# Altium schematic sheet TOP_LEVEL.SchDoc
size Tabloid; SheetNumber: 1; SheetTotal: 11
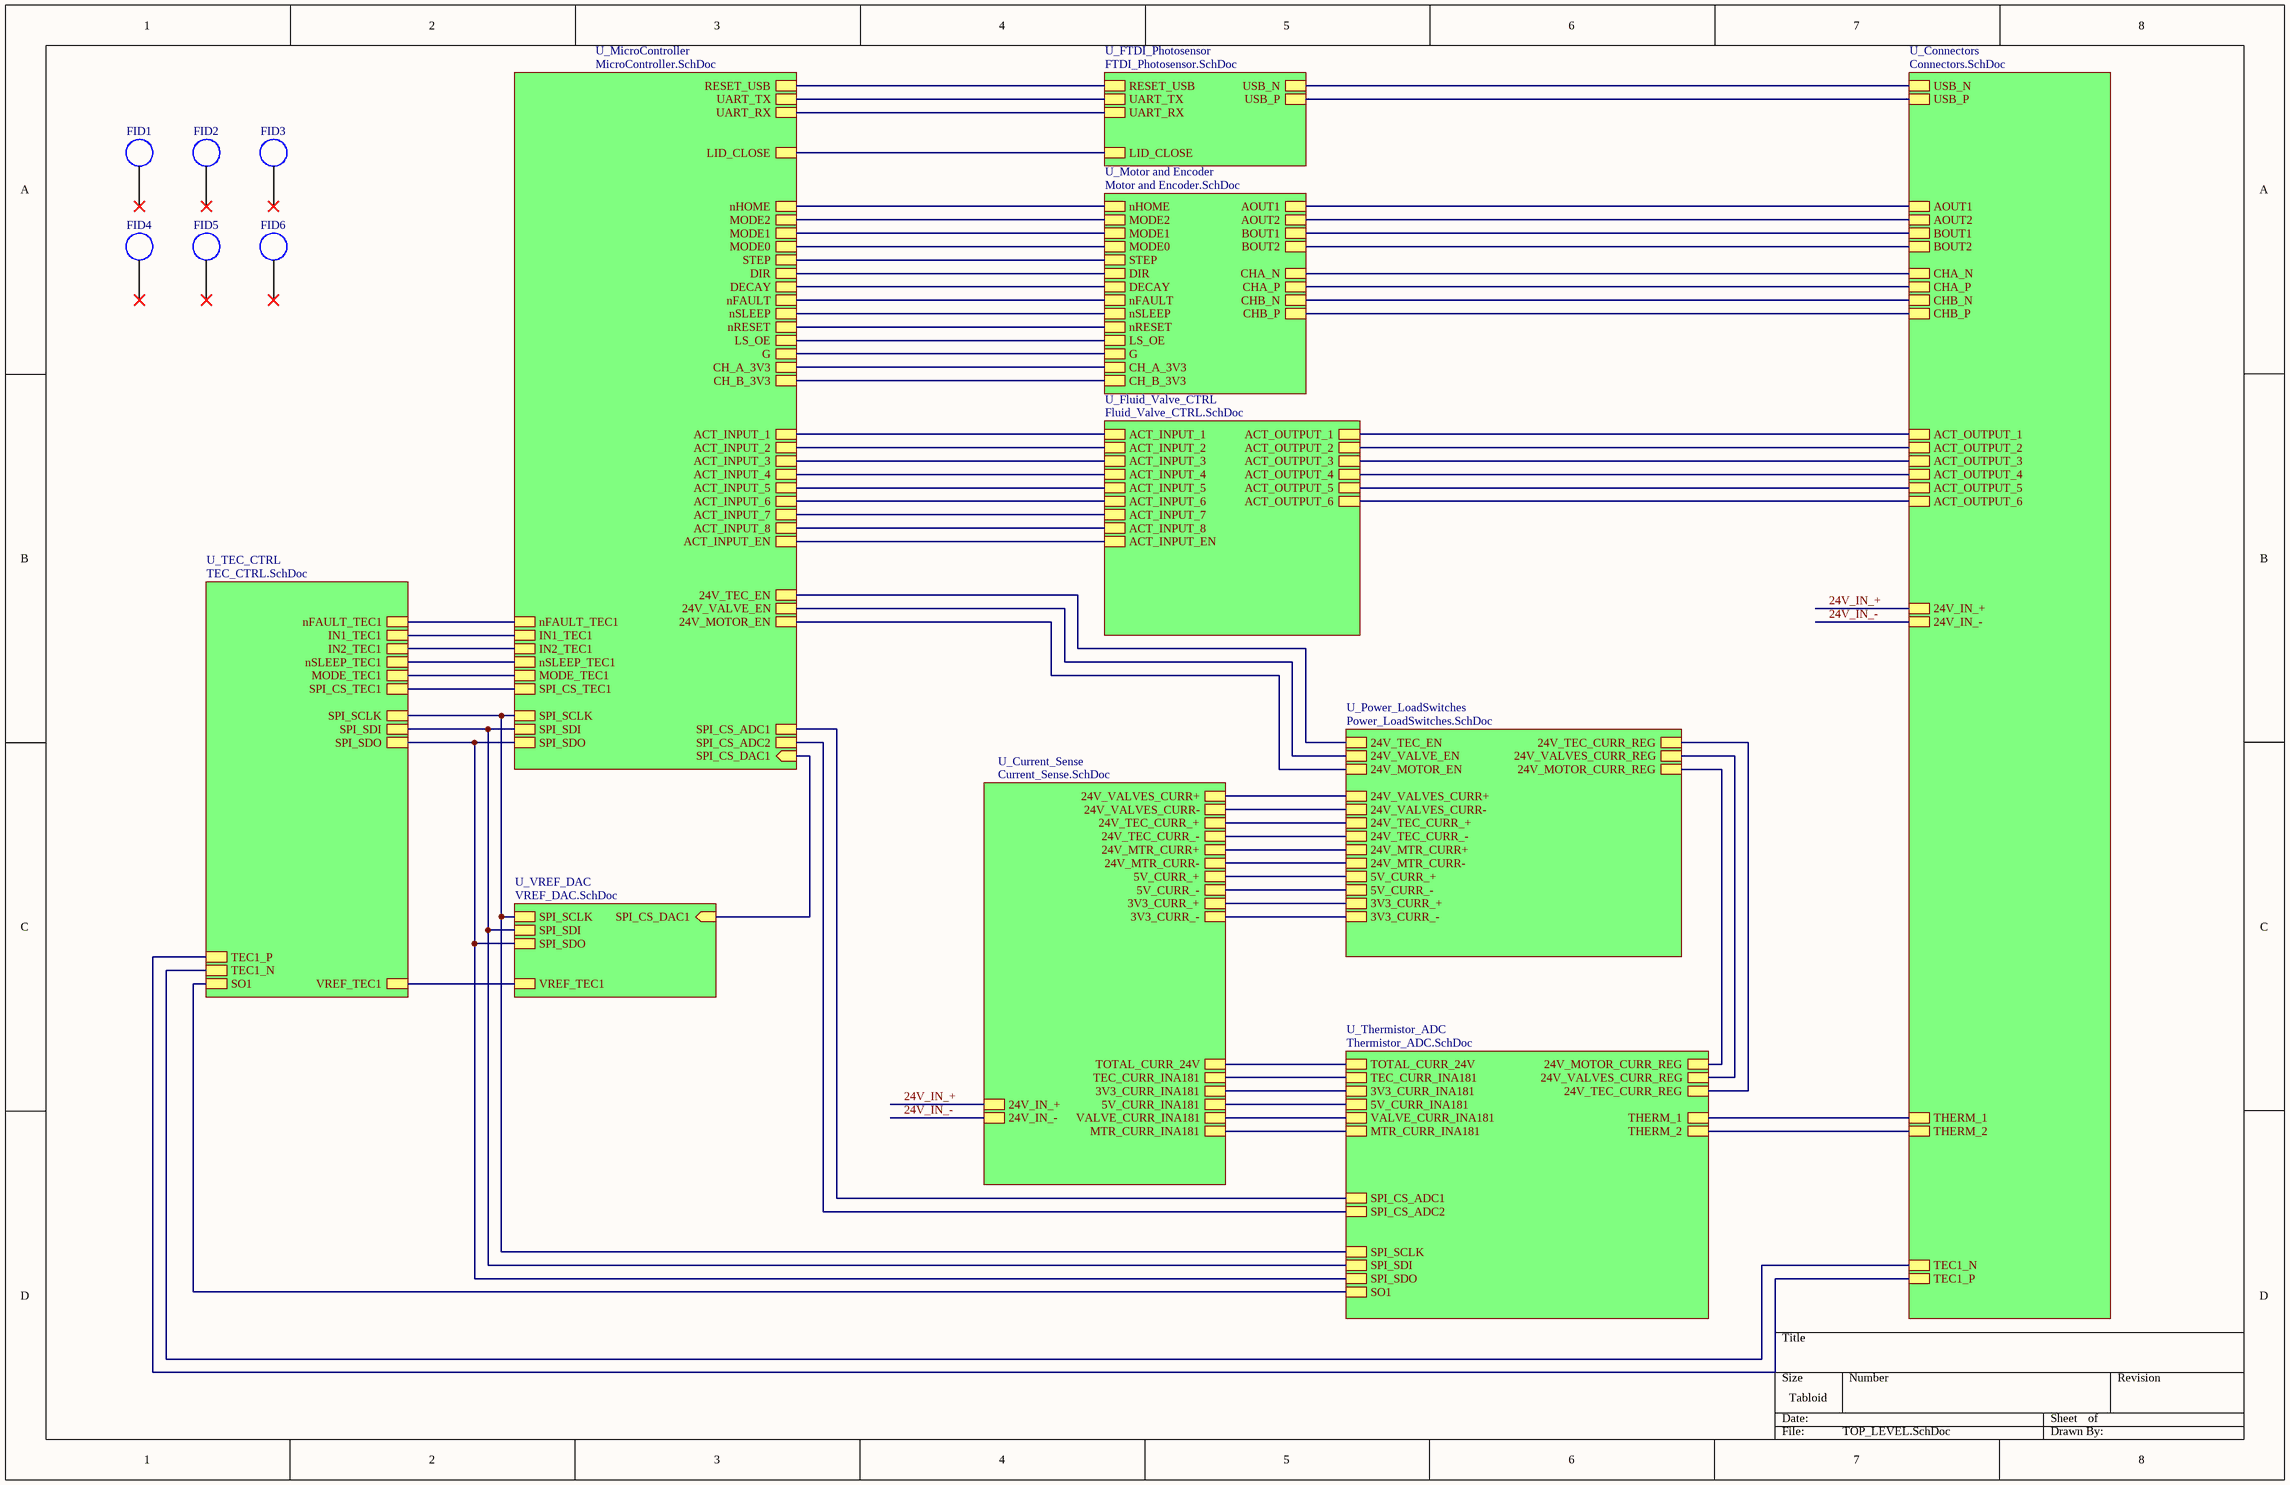
[diagram p0: TOP_LEVEL.SchDoc]

## Parts
FID1  FIDUCIAL  [Fiducial]  (value not drawn)
FID2  FIDUCIAL  [Fiducial]  (value not drawn)
FID3  FIDUCIAL  [Fiducial]  (value not drawn)
FID4  FIDUCIAL  [Fiducial]  (value not drawn)
FID5  FIDUCIAL  [Fiducial]  (value not drawn)
FID6  FIDUCIAL  [Fiducial]  (value not drawn)

## Sub-sheets
U_Connectors = Connectors.SchDoc: 24V_IN_+, 24V_IN_-, TEC1_P, TEC1_N, THERM_1, THERM_2, ACT_OUTPUT_1, ACT_OUTPUT_2, ACT_OUTPUT_3, ACT_OUTPUT_4, ACT_OUTPUT_5, ACT_OUTPUT_6, CHA_N, CHA_P, CHB_N, CHB_P, AOUT1, AOUT2, BOUT1, BOUT2, USB_N, USB_P
U_Current_Sense = Current_Sense.SchDoc: 24V_TEC_CURR_+, 24V_TEC_CURR_-, TEC_CURR_INA181, TOTAL_CURR_24V, 24V_IN_+, 24V_IN_-, 24V_VALVES_CURR+, 24V_VALVES_CURR-, VALVE_CURR_INA181, 5V_CURR_INA181, 3V3_CURR_INA181, 5V_CURR_+, 5V_CURR_-, 3V3_CURR_+, 3V3_CURR_-, 24V_MTR_CURR+, 24V_MTR_CURR-, MTR_CURR_INA181
U_Fluid_Valve_CTRL = Fluid_Valve_CTRL.SchDoc: ACT_INPUT_1, ACT_INPUT_2, ACT_INPUT_3, ACT_INPUT_4, ACT_OUTPUT_1, ACT_OUTPUT_2, ACT_OUTPUT_3, ACT_OUTPUT_4, ACT_INPUT_5, ACT_INPUT_6, ACT_INPUT_7, ACT_INPUT_8, ACT_OUTPUT_5, ACT_OUTPUT_6, ACT_INPUT_EN
U_FTDI_Photosensor = FTDI_Photosensor.SchDoc: RESET_USB, USB_N, USB_P, UART_TX, UART_RX, LID_CLOSE
U_MicroController = MicroController.SchDoc: UART_TX, UART_RX, nHOME, nFAULT, nSLEEP, nRESET, SPI_CS_DAC1 (in), SPI_CS_ADC1, SPI_CS_ADC2, CH_A_3V3, CH_B_3V3, IN1_TEC1, IN2_TEC1, nSLEEP_TEC1, MODE_TEC1, SPI_SCLK, SPI_SDI, SPI_CS_TEC1, nFAULT_TEC1, LS_OE, G, MODE2, MODE1, MODE0, STEP, DIR, DECAY, 24V_MOTOR_EN, 24V_VALVE_EN, 24V_TEC_EN, LID_CLOSE, SPI_SDO, ACT_INPUT_EN, RESET_USB, ACT_INPUT_1, ACT_INPUT_2, ACT_INPUT_3, ACT_INPUT_4, ACT_INPUT_5, ACT_INPUT_6, ACT_INPUT_7, ACT_INPUT_8
U_Motor and Encoder = Motor and Encoder.SchDoc: AOUT1, AOUT2, BOUT1, BOUT2, nHOME, MODE2, MODE1, MODE0, STEP, DIR, DECAY, nFAULT, nSLEEP, nRESET, CHA_N, CHA_P, CHB_N, CHB_P, G, CH_A_3V3, CH_B_3V3, LS_OE
U_Power_LoadSwitches = Power_LoadSwitches.SchDoc: 24V_TEC_EN, 24V_TEC_CURR_REG, 24V_VALVE_EN, 24V_VALVES_CURR_REG, 24V_VALVES_CURR+, 24V_VALVES_CURR-, 24V_TEC_CURR_+, 24V_TEC_CURR_-, 24V_MOTOR_EN, 24V_MOTOR_CURR_REG, 24V_MTR_CURR+, 24V_MTR_CURR-, 5V_CURR_+, 5V_CURR_-, 3V3_CURR_+, 3V3_CURR_-
U_TEC_CTRL = TEC_CTRL.SchDoc: IN1_TEC1, IN2_TEC1, nSLEEP_TEC1, MODE_TEC1, SPI_SCLK, SPI_SDI, SPI_CS_TEC1, SPI_SDO, nFAULT_TEC1, TEC1_P, TEC1_N, SO1, VREF_TEC1
U_Thermistor_ADC = Thermistor_ADC.SchDoc: THERM_1, THERM_2, SPI_CS_ADC1, 24V_TEC_CURR_REG, 24V_VALVES_CURR_REG, TEC_CURR_INA181, TOTAL_CURR_24V, VALVE_CURR_INA181, SPI_CS_ADC2, SPI_SDO, SPI_SDI, SPI_SCLK, 5V_CURR_INA181, 3V3_CURR_INA181, 24V_MOTOR_CURR_REG, SO1, MTR_CURR_INA181
U_VREF_DAC = VREF_DAC.SchDoc: VREF_TEC1, SPI_CS_DAC1 (in), SPI_SCLK, SPI_SDI, SPI_SDO

## Nets
24V_IN_+: sheet U_Current_Sense/24V_IN_+, sheet U_Connectors/24V_IN_+
24V_IN_-: sheet U_Current_Sense/24V_IN_-, sheet U_Connectors/24V_IN_-
(unnamed): sheet U_Motor and Encoder/AOUT1, sheet U_Connectors/AOUT1
(unnamed): sheet U_Motor and Encoder/AOUT2, sheet U_Connectors/AOUT2
(unnamed): sheet U_Motor and Encoder/BOUT1, sheet U_Connectors/BOUT1
(unnamed): sheet U_Motor and Encoder/BOUT2, sheet U_Connectors/BOUT2
(unnamed): sheet U_Motor and Encoder/nHOME, sheet U_MicroController/nHOME
(unnamed): sheet U_Motor and Encoder/MODE2, sheet U_MicroController/MODE2
(unnamed): sheet U_Motor and Encoder/MODE1, sheet U_MicroController/MODE1
(unnamed): sheet U_Motor and Encoder/MODE0, sheet U_MicroController/MODE0
(unnamed): sheet U_Motor and Encoder/STEP, sheet U_MicroController/STEP
(unnamed): sheet U_Motor and Encoder/DIR, sheet U_MicroController/DIR
(unnamed): sheet U_Motor and Encoder/DECAY, sheet U_MicroController/DECAY
(unnamed): sheet U_Motor and Encoder/nFAULT, sheet U_MicroController/nFAULT
(unnamed): sheet U_Motor and Encoder/nSLEEP, sheet U_MicroController/nSLEEP
(unnamed): sheet U_Motor and Encoder/nRESET, sheet U_MicroController/nRESET
(unnamed): sheet U_Motor and Encoder/CHA_N, sheet U_Connectors/CHA_N
(unnamed): sheet U_Motor and Encoder/CHA_P, sheet U_Connectors/CHA_P
(unnamed): sheet U_Motor and Encoder/CHB_N, sheet U_Connectors/CHB_N
(unnamed): sheet U_Motor and Encoder/CHB_P, sheet U_Connectors/CHB_P
(unnamed): sheet U_Motor and Encoder/G, sheet U_MicroController/G
(unnamed): sheet U_Motor and Encoder/CH_A_3V3, sheet U_MicroController/CH_A_3V3
(unnamed): sheet U_Motor and Encoder/CH_B_3V3, sheet U_MicroController/CH_B_3V3
(unnamed): sheet U_Motor and Encoder/LS_OE, sheet U_MicroController/LS_OE
(unnamed): sheet U_Power_LoadSwitches/24V_TEC_EN, sheet U_MicroController/24V_TEC_EN
(unnamed): sheet U_Power_LoadSwitches/24V_TEC_CURR_REG, sheet U_Thermistor_ADC/24V_TEC_CURR_REG
(unnamed): sheet U_Power_LoadSwitches/24V_VALVE_EN, sheet U_MicroController/24V_VALVE_EN
(unnamed): sheet U_Power_LoadSwitches/24V_VALVES_CURR_REG, sheet U_Thermistor_ADC/24V_VALVES_CURR_REG
(unnamed): sheet U_Power_LoadSwitches/24V_VALVES_CURR+, sheet U_Current_Sense/24V_VALVES_CURR+
(unnamed): sheet U_Power_LoadSwitches/24V_VALVES_CURR-, sheet U_Current_Sense/24V_VALVES_CURR-
(unnamed): sheet U_Power_LoadSwitches/24V_TEC_CURR_+, sheet U_Current_Sense/24V_TEC_CURR_+
(unnamed): sheet U_Power_LoadSwitches/24V_TEC_CURR_-, sheet U_Current_Sense/24V_TEC_CURR_-
(unnamed): sheet U_Power_LoadSwitches/24V_MOTOR_EN, sheet U_MicroController/24V_MOTOR_EN
(unnamed): sheet U_Power_LoadSwitches/24V_MOTOR_CURR_REG, sheet U_Thermistor_ADC/24V_MOTOR_CURR_REG
(unnamed): sheet U_Power_LoadSwitches/24V_MTR_CURR+, sheet U_Current_Sense/24V_MTR_CURR+
(unnamed): sheet U_Power_LoadSwitches/24V_MTR_CURR-, sheet U_Current_Sense/24V_MTR_CURR-
(unnamed): sheet U_Power_LoadSwitches/5V_CURR_+, sheet U_Current_Sense/5V_CURR_+
(unnamed): sheet U_Power_LoadSwitches/5V_CURR_-, sheet U_Current_Sense/5V_CURR_-
(unnamed): sheet U_Power_LoadSwitches/3V3_CURR_+, sheet U_Current_Sense/3V3_CURR_+
(unnamed): sheet U_Power_LoadSwitches/3V3_CURR_-, sheet U_Current_Sense/3V3_CURR_-
(unnamed): sheet U_TEC_CTRL/IN1_TEC1, sheet U_MicroController/IN1_TEC1
(unnamed): sheet U_TEC_CTRL/IN2_TEC1, sheet U_MicroController/IN2_TEC1
(unnamed): sheet U_TEC_CTRL/nSLEEP_TEC1, sheet U_MicroController/nSLEEP_TEC1
(unnamed): sheet U_TEC_CTRL/MODE_TEC1, sheet U_MicroController/MODE_TEC1
(unnamed): sheet U_TEC_CTRL/SPI_SCLK, sheet U_Thermistor_ADC/SPI_SCLK, sheet U_VREF_DAC/SPI_SCLK, sheet U_MicroController/SPI_SCLK
(unnamed): sheet U_TEC_CTRL/SPI_SDI, sheet U_Thermistor_ADC/SPI_SDI, sheet U_VREF_DAC/SPI_SDI, sheet U_MicroController/SPI_SDI
(unnamed): sheet U_TEC_CTRL/SPI_CS_TEC1, sheet U_MicroController/SPI_CS_TEC1
(unnamed): sheet U_TEC_CTRL/SPI_SDO, sheet U_Thermistor_ADC/SPI_SDO, sheet U_VREF_DAC/SPI_SDO, sheet U_MicroController/SPI_SDO
(unnamed): sheet U_TEC_CTRL/nFAULT_TEC1, sheet U_MicroController/nFAULT_TEC1
(unnamed): sheet U_TEC_CTRL/TEC1_P, sheet U_Connectors/TEC1_P
(unnamed): sheet U_TEC_CTRL/TEC1_N, sheet U_Connectors/TEC1_N
(unnamed): sheet U_TEC_CTRL/SO1, sheet U_Thermistor_ADC/SO1
(unnamed): sheet U_TEC_CTRL/VREF_TEC1, sheet U_VREF_DAC/VREF_TEC1
(unnamed): sheet U_Fluid_Valve_CTRL/ACT_INPUT_1, sheet U_MicroController/ACT_INPUT_1
(unnamed): sheet U_Fluid_Valve_CTRL/ACT_INPUT_2, sheet U_MicroController/ACT_INPUT_2
(unnamed): sheet U_Fluid_Valve_CTRL/ACT_INPUT_3, sheet U_MicroController/ACT_INPUT_3
(unnamed): sheet U_Fluid_Valve_CTRL/ACT_INPUT_4, sheet U_MicroController/ACT_INPUT_4
(unnamed): sheet U_Fluid_Valve_CTRL/ACT_OUTPUT_1, sheet U_Connectors/ACT_OUTPUT_1
(unnamed): sheet U_Fluid_Valve_CTRL/ACT_OUTPUT_2, sheet U_Connectors/ACT_OUTPUT_2
(unnamed): sheet U_Fluid_Valve_CTRL/ACT_OUTPUT_3, sheet U_Connectors/ACT_OUTPUT_3
(unnamed): sheet U_Fluid_Valve_CTRL/ACT_OUTPUT_4, sheet U_Connectors/ACT_OUTPUT_4
(unnamed): sheet U_Fluid_Valve_CTRL/ACT_INPUT_5, sheet U_MicroController/ACT_INPUT_5
(unnamed): sheet U_Fluid_Valve_CTRL/ACT_INPUT_6, sheet U_MicroController/ACT_INPUT_6
(unnamed): sheet U_Fluid_Valve_CTRL/ACT_INPUT_7, sheet U_MicroController/ACT_INPUT_7
(unnamed): sheet U_Fluid_Valve_CTRL/ACT_INPUT_8, sheet U_MicroController/ACT_INPUT_8
(unnamed): sheet U_Fluid_Valve_CTRL/ACT_OUTPUT_5, sheet U_Connectors/ACT_OUTPUT_5
(unnamed): sheet U_Fluid_Valve_CTRL/ACT_OUTPUT_6, sheet U_Connectors/ACT_OUTPUT_6
(unnamed): sheet U_Fluid_Valve_CTRL/ACT_INPUT_EN, sheet U_MicroController/ACT_INPUT_EN
(unnamed): sheet U_Thermistor_ADC/THERM_1, sheet U_Connectors/THERM_1
(unnamed): sheet U_Thermistor_ADC/THERM_2, sheet U_Connectors/THERM_2
(unnamed): sheet U_Thermistor_ADC/SPI_CS_ADC1, sheet U_MicroController/SPI_CS_ADC1
(unnamed): sheet U_Thermistor_ADC/TEC_CURR_INA181, sheet U_Current_Sense/TEC_CURR_INA181
(unnamed): sheet U_Thermistor_ADC/TOTAL_CURR_24V, sheet U_Current_Sense/TOTAL_CURR_24V
(unnamed): sheet U_Thermistor_ADC/VALVE_CURR_INA181, sheet U_Current_Sense/VALVE_CURR_INA181
(unnamed): sheet U_Thermistor_ADC/SPI_CS_ADC2, sheet U_MicroController/SPI_CS_ADC2
(unnamed): sheet U_Thermistor_ADC/5V_CURR_INA181, sheet U_Current_Sense/5V_CURR_INA181
(unnamed): sheet U_Thermistor_ADC/3V3_CURR_INA181, sheet U_Current_Sense/3V3_CURR_INA181
(unnamed): sheet U_Thermistor_ADC/MTR_CURR_INA181, sheet U_Current_Sense/MTR_CURR_INA181
(unnamed): sheet U_VREF_DAC/SPI_CS_DAC1, sheet U_MicroController/SPI_CS_DAC1
(unnamed): sheet U_FTDI_Photosensor/RESET_USB, sheet U_MicroController/RESET_USB
(unnamed): sheet U_FTDI_Photosensor/USB_N, sheet U_Connectors/USB_N
(unnamed): sheet U_FTDI_Photosensor/USB_P, sheet U_Connectors/USB_P
(unnamed): sheet U_FTDI_Photosensor/UART_TX, sheet U_MicroController/UART_TX
(unnamed): sheet U_FTDI_Photosensor/UART_RX, sheet U_MicroController/UART_RX
(unnamed): sheet U_FTDI_Photosensor/LID_CLOSE, sheet U_MicroController/LID_CLOSE

Not connected (* = marked no-connect by the designer): FID1 FID(0)*; FID2 FID(0)*; FID3 FID(0)*; FID4 FID(0)*; FID5 FID(0)*; FID6 FID(0)*

## Library data of the parts
FID1-FID6 = FIDUCIAL: 40mil Fudicial